# Altium project PCB_Project_1.PrjPcb
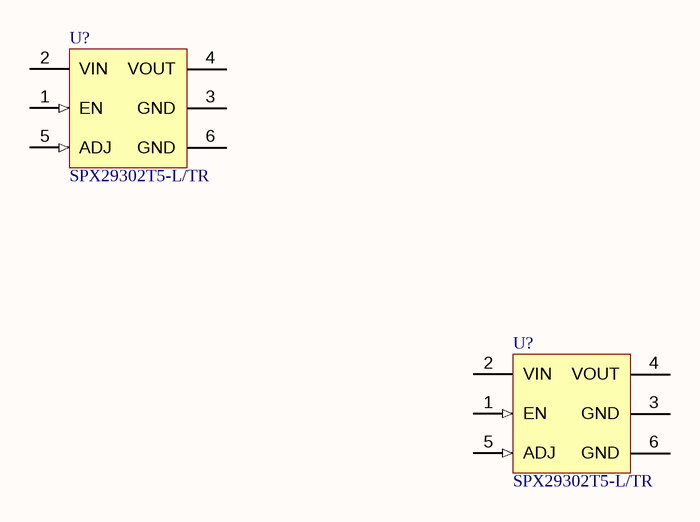
[diagram p0: Sheet1.SchDoc]
CAGE_CODE: ?????; CONTRACT_NUMBER: <CONTRACT NO>; DOC_NO_ASSY_DWG: <ASSY DWG NO>; DOC_NO_BOM: <BOM DOC NO>; DOC_NO_FAB_DWG: <FAB DWG NO>; DOC_NO_SCH_DWG: <SCH DWG NO>; PCB_2_DEC_TOL: +/-.01; PCB_3_DEC_TOL: +/-.010; PCB_ANG_TOL: +/-1/2; PCB_ASSEMBLY_NO: <PCB ASSY NO>; PCB_CHECKER: - -----; PCB_CHECKER_APP_DATE: --/--/----; PCB_DESIGNER: - -----; PCB_DESIGNER_APP_DATE: --/--/----; PCB_DWG_NO: <PCB DWG NO>; PCB_ENGINEER: - -----; PCB_ENGINEER_APP_DATE: --/--/----; PCB_PART_NUMBER: <PCB PN>; PCB_REV: A; SCH_REV: A
1 sheet, 2 parts. Net scope: global (net labels, ports and power ports of the same name join across sheets).
Board file: PCB1.PcbDoc

## Sheet Sheet1.SchDoc
size 431 x 279 mm; SheetNumber: 1; SheetTotal: 1; ENG_APP_DATE: --/--/--; DSN_APP_DATE: --/--/--; CHK_APP_DATE: --/--/--

### Parts
(Parts that share a designator on the sheet are numbered #1, #2 ... from top to bottom, then left to right.)
U?#1  SPX29302T5-L/TR  [EXAR-TO263-5_M]
U?#2  SPX29302T5-L/TR  [EXAR-TO263-5_M]

### Nets

Not connected (* = marked no-connect by the designer): U?#1 1(EN) 2(VIN) 3(GND) 4(VOUT) 5(ADJ) 6(GND); U?#2 1(EN) 2(VIN) 3(GND) 4(VOUT) 5(ADJ) 6(GND)

### Notes on the sheet
- DWG. NO.
- REV.
- SHT.
- THIS DOCUMENT AND THE DATA DISCLOSED HEREIN OR HEREWITH IS THE PROPERTY OF ALTIUM LIMITED AND MAY BE FREELY DISTRIBUTED IN WHOLE. NO RIGHTS ARE RESERVED OR EXPRESS OR IMPLIED WARANTEE GIVEN.
- REVISION
- DESCRIPTION
- DATE
- APPROVED
- ENG:
- APPROVALS
- PROJECT
- DSN:
- CHK:
- REFERENCE DOCUMENTS
- PROJECT REVISION:
- TITLE
- DOCUMENT REVISION:
- DESIGN ITEM:
- BOM:
- FAB DWG:
- PCB DWG:
- ASSY DWG:
- SCALE:
- SIZE
- B
- CAGE CODE
- FILE NAME
- DWG NO.
- SHEET
- OF
- REV

### Library data of the parts
U?#1 U?#2 = CMP-019-00033-3: Highly Accurate Voltage Regulator, 3 A, 1.25 to 16 V, -40 to 125 degC, 6-Pin DPAK, RoHS, Tape and Reel; Manufacturer: Exar Corporation; Pins: 6; Manufacturer URL: https://www.exar.com/; Package Description: 6-Pin Transistor Outline, Body 9.015 x 10.16 mm, Pitch 1.7 mm; Datasheet URL: https://www.exar.com/content/document.ashx?id=1328; Mounting Technology: SM; Max Operating Temperature: 125°C; RoHS Compliant: True; Package Reference: DPAK; Packaging: TapeandReel; Datasheet Version: Rev. 2.1.0, 10/2011; Min Operating Temperature: -40°C; Voltage: 1.25to16V; Case/Package: DPAK